# EAGLE board controller-teensy-4 (EAGLE 6.4)
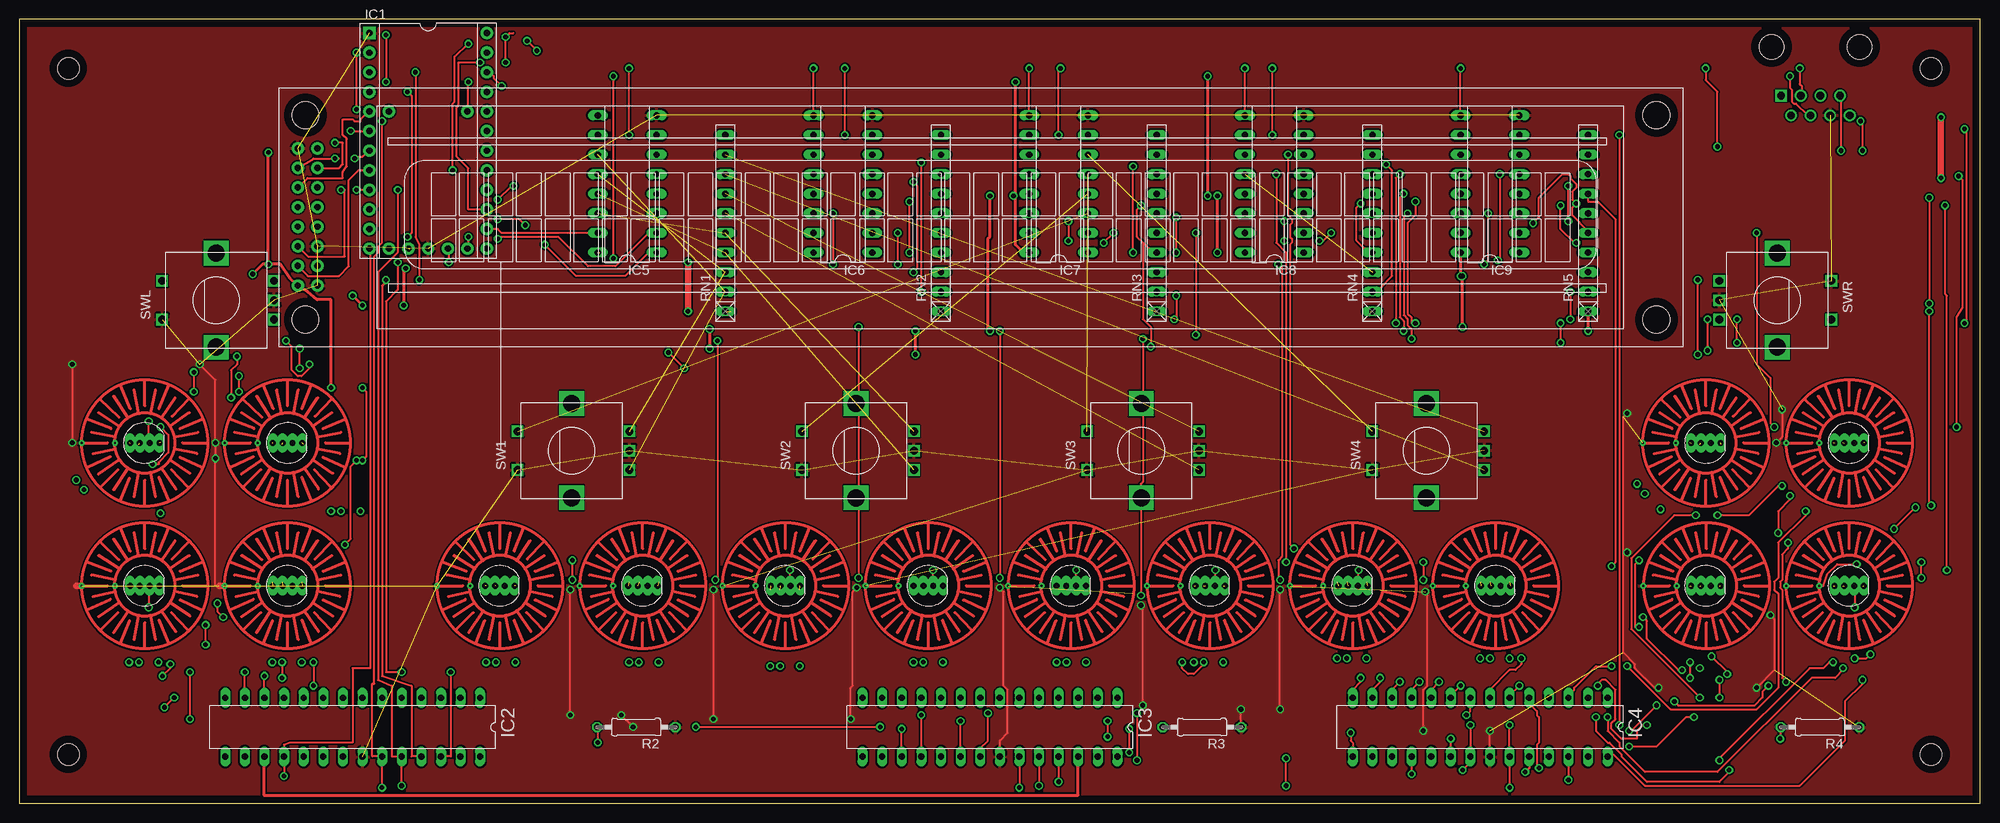
[diagram p1: board, top side]
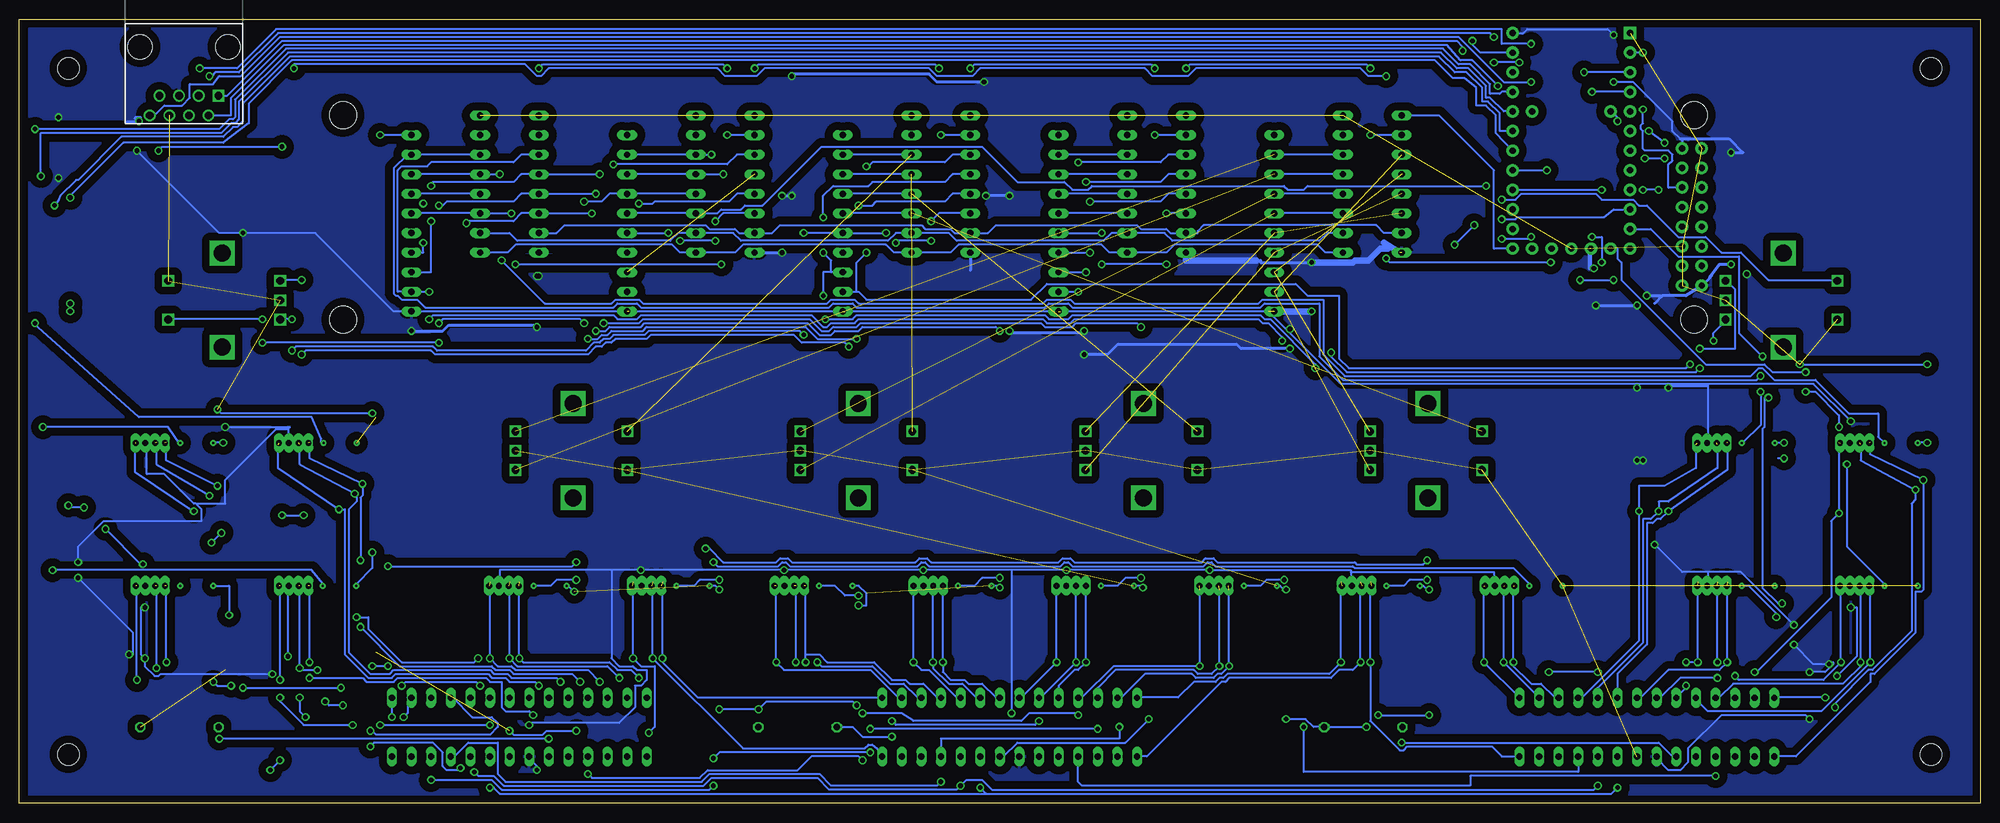
[diagram p2: board, bottom side, seen from below]

Size 254 x 101.6 mm. Coordinates in mm from the lower left corner, seen from the top.
Outline: 0,0 254,0 254,101.6 0,101.6 0,0
Copper layers (1*16): Top 0.035mm / dielectric 1.5mm / Bottom 0.035mm
Design rules "default": minimum track width 10mil, minimum drill 24mil, track to track 8mil, track to pad 8mil, pad to pad 8mil, via to via 8mil, smd to smd 8mil, copper to edge 40mil, drill to drill 8mil, minimum pad ring 10mil, minimum via ring 8mil, stop-mask expansion 4mil, vias tented up to drill 0mil, thermal gap 10mil
Holes 2.8 mm at 6.35,95.25 6.35,6.35 247.65,6.35 247.65,95.25

## Footprints (pad centres in the part's own frame; a part is rotated, then mirrored left to right if it is on the bottom)
LED-RGB-THRU = drill 0.762 pad 0.889 long: 1 1.905,0; 2 0.635,0; 3 -0.635,0 | drill 0.762 pad 0.508 long: 4 -1.905,0
RJ45-8 = drill 1 square: 1 -4.445,6.35 | drill 1: 2 -3.175,8.89; 3 -1.905,6.35; 4 -0.635,8.89; 5 0.635,6.35; 6 1.905,8.89; 7 3.175,6.35; 8 4.445,8.89 | hole 3.2: -5.715,0; 5.715,0
TEENSY = drill 0.813 pad 1.6: 5V2 13.97,-2.54; +5V -13.97,7.62; B0 -11.43,-7.62; B1 -8.89,-7.62; B2 -6.35,-7.62; B3 -3.81,-7.62; B4 8.89,7.62; B5 6.35,7.62; B6 3.81,7.62; B7 -1.27,-7.62; C6 11.43,-7.62; C7 13.97,-7.62; D0 1.27,-7.62; D1 3.81,-7.62; D2 6.35,-7.62; D3 8.89,-7.62; D4 13.97,5.08; D5 13.97,-5.08; D6 13.97,7.62; D7 11.43,7.62; E6 -3.81,-5.08; F0 -11.43,7.62; F1 -8.89,7.62; F4 -6.35,7.62; F5 -3.81,7.62; F6 -1.27,7.62; F7 1.27,7.62; GRND1 13.97,0; REF -3.81,5.08; RST 13.97,2.54 | drill 0.813 pad 1.6 square: GND -13.97,-7.62
DIP28 = drill 0.813 long: 1 -15.24,-3.81; 2 -12.7,-3.81; 3 -10.16,-3.81; 4 -7.62,-3.81; 5 -5.08,-3.81; 6 -2.54,-3.81; 7 0,-3.81; 8 2.54,-3.81; 9 5.08,-3.81; 10 7.62,-3.81; 11 10.16,-3.81; 12 12.7,-3.81; 13 15.24,-3.81; 14 17.78,-3.81; 15 17.78,3.81; 16 15.24,3.81; 17 12.7,3.81; 18 10.16,3.81; 19 7.62,3.81; 20 5.08,3.81; 21 2.54,3.81; 22 0,3.81; 23 -2.54,3.81; 24 -5.08,3.81; 25 -7.62,3.81; 26 -10.16,3.81; 27 -12.7,3.81; 28 -15.24,3.81
DIL16 = drill 0.813 long: 1 -8.89,-3.81; 2 -6.35,-3.81; 3 -3.81,-3.81; 4 -1.27,-3.81; 5 1.27,-3.81; 6 3.81,-3.81; 7 6.35,-3.81; 8 8.89,-3.81; 9 8.89,3.81; 10 6.35,3.81; 11 3.81,3.81; 12 1.27,3.81; 13 -1.27,3.81; 14 -3.81,3.81; 15 -6.35,3.81; 16 -8.89,3.81
0207/10 = drill 0.813 octagon: 1 -5.08,0; 2 5.08,0
RN-10 = drill 0.813 long: 1 -11.43,0; 2 -8.89,0; 3 -6.35,0; 4 -3.81,0; 5 -1.27,0; 6 1.27,0; 7 3.81,0; 8 6.35,0; 9 8.89,0; 10 11.43,0
ALPS_EC12E_SW = drill 1 square: A -2.5,-7.5; B 2.5,-7.5; C 0,-7.5; D -2.5,7; E 2.5,7 | drill 2.2 square: GND1 -6.1,0; GND2 6.1,0
BMP = drill 0.254: P$1 -8.159,0; P$2 -3.858,0
LCD1602 = drill 0.813 pad 1.6: 1 5.04,7.92; 2 2.5,7.92; 3 5.04,10.46; 4 2.5,10.46; 5 5.04,13; 6 2.5,13; 7 5.04,15.54; 8 2.5,15.54; 9 5.04,18.08; 10 2.5,18.08; 11 5.04,20.62; 12 2.5,20.62; 13 5.04,23.16; 14 2.5,23.16; 15 5.04,25.7; 16 2.5,25.7 | hole 3.5: 3.5,3.5; 3.5,30; 178.5,30; 178.5,3.5

## Placement (x,y rotation side)
D1  LED-RGB-CA-THRUDIFFUSE  [LED-RGB-THRU]  62.25,28.2 0 top
D2  LED-RGB-CA-THRUDIFFUSE  [LED-RGB-THRU]  80.75,28.2 0 top
D3  LED-RGB-CA-THRUDIFFUSE  [LED-RGB-THRU]  99.25,28.2 0 top
D4  LED-RGB-CA-THRUDIFFUSE  [LED-RGB-THRU]  117.75,28.2 0 top
D5  LED-RGB-CA-THRUDIFFUSE  [LED-RGB-THRU]  136.25,28.2 0 top
D6  LED-RGB-CA-THRUDIFFUSE  [LED-RGB-THRU]  154.25,28.2 0 top
D7  LED-RGB-CA-THRUDIFFUSE  [LED-RGB-THRU]  172.75,28.2 0 top
D8  LED-RGB-CA-THRUDIFFUSE  [LED-RGB-THRU]  191.25,28.2 0 top
DL1  LED-RGB-CA-THRUDIFFUSE  [LED-RGB-THRU]  16.25,46.7 0 top
DL2  LED-RGB-CA-THRUDIFFUSE  [LED-RGB-THRU]  34.75,46.7 0 top
DL3  LED-RGB-CA-THRUDIFFUSE  [LED-RGB-THRU]  16.25,28.2 0 top
DL4  LED-RGB-CA-THRUDIFFUSE  [LED-RGB-THRU]  34.75,28.2 0 top
DR1  LED-RGB-CA-THRUDIFFUSE  [LED-RGB-THRU]  218.46,46.7 0 top
DR2  LED-RGB-CA-THRUDIFFUSE  [LED-RGB-THRU]  237.04,46.7 0 top
DR3  LED-RGB-CA-THRUDIFFUSE  [LED-RGB-THRU]  218.46,28.2 0 top
DR4  LED-RGB-CA-THRUDIFFUSE  [LED-RGB-THRU]  237.04,28.2 0 top
EXPANSION  RJ45-8PTH  [RJ45-8]  232.66,98.04 180 bottom
IC1  TEENSY  [TEENSY]  52.96,85.85 270 top
IC2  LEDPWM1  [DIP28]  44.45,9.88 180 top
IC3  LEDPWM2  [DIP28]  127,9.88 180 top
IC4  LEDPWM3  [DIP28]  190.5,9.88 180 top
IC5  74HC165-PN  [DIL16]  78.74,80.26 90 top
IC6  74HC165-PN  [DIL16]  106.68,80.26 90 top
IC7  74HC165-PN  [DIL16]  134.62,80.26 90 top
IC8  74HC165-PN  [DIL16]  162.56,80.26 90 top
IC9  74HC165-PN  [DIL16]  190.5,80.26 90 top
R2  2k  [0207/10]  79.91,9.88 180 top
R3  2k  [0207/10]  153.2,9.88 180 top
R4  2k  [0207/10]  233.24,9.88 180 top
RN1  10k  [RN-10]  91.44,75.18 90 top
RN2  10k  [RN-10]  119.38,75.18 90 top
RN3  10k  [RN-10]  147.32,75.18 90 top
RN4  10k  [RN-10]  175.26,75.18 90 top
RN5  10k  [RN-10]  203.2,75.18 90 top
SW1  EC12E_SW  [ALPS_EC12E_SW]  71.53,45.7 90 top
SW2  EC12E_SW  [ALPS_EC12E_SW]  108.39,45.7 90 top
SW3  EC12E_SW  [ALPS_EC12E_SW]  145.32,45.7 90 top
SW4  EC12E_SW  [ALPS_EC12E_SW]  182.25,45.7 90 top
SWCH1  [BMP]  62.25,28.2 0 top
SWCH2  [BMP]  80.75,28.2 0 top
SWCH3  [BMP]  99.25,28.2 0 top
SWCH4  [BMP]  117.75,28.2 0 top
SWCH5  [BMP]  136.25,28.2 0 top
SWCH6  [BMP]  154.25,28.2 0 top
SWCH7  [BMP]  172.75,28.2 0 top
SWCH8  [BMP]  191.25,28.2 0 top
SWL  EC12E_SW  [ALPS_EC12E_SW]  25.5,65.2 90 top
SWL1  [BMP]  16.25,46.7 0 top
SWL2  [BMP]  34.75,46.7 0 top
SWL3  [BMP]  16.25,28.2 0 top
SWL4  [BMP]  34.75,28.2 0 top
SWR  EC12E_SW  [ALPS_EC12E_SW]  227.71,65.2 270 top
SWR1  [BMP]  218.46,46.7 0 top
SWR2  [BMP]  237.04,46.7 0 top
SWR3  [BMP]  218.54,28.2 0 top
SWR4  [BMP]  237.04,28.2 0 top
X1  HD44780LCD-1602  [LCD1602]  33.57,59.18 0 top

## Tracks (layer width: path | path; a pad name or v marks a point on that pad's centre or on a via)
+5V  (via drill 0.6)  (6 unrouted)
  Top 0.254: v47.5,99.57 v47.5,93.47 | v246.38,29.21 v246.38,31.24 | v239.78,19.3 239.27,18.8 v237.74,18.8 | v237.74,25.4 237.74,28.19 DR4.2 | v219.2,19.05 221.23,17.02 v221.23,16.76 | v173.48,30.23 173.48,28.45 D7.2 | v154.94,30.23 154.94,28.45 D6.2 | v186.94,4.32 187.71,5.08 187.71,6.1 187.96,6.35 v187.96,10.16 | v136.91,30.23 136.91,28.45 D5.2 | v118.36,30.23 118.36,28.45 D4.2 | v99.82,30.23 99.82,28.45 D3.2 | v125.48,11.68 125.48,8.13 124.46,7.11 IC3.21 | v24.13,20.57 v24.13,23.11 | v19.56,18.03 19.56,17.53 v18.54,16.51 | v16.76,25.4 16.76,28.19 DL3.2 | v238.51,88.39 238.76,88.14 v238.76,84.58 | v16.76,49.53 16.76,46.74 DL1.2 | v22.1,17.02 v22.1,10.92 | v227.33,48.77 226.82,49.28 226.82,55.12 225.04,56.9 v225.04,73.91 | v44.45,44.45 44.96,44.96 44.96,53.34 v44.45,53.85 | v43.69,44.45 42.93,43.69 42.93,34.29 v42.16,33.53
  Top 0.406: IC7.16 130.81,70.87 130.56,70.87 129.03,72.39 129.03,78.49 v128.78,78.74 129.03,78.74 v129.03,93.47 | v125.73,78.74 125.73,73.41 125.48,73.15 125.48,61.47 v125.73,61.21 | v116.08,58.17 v116.08,61.21 | v89.41,61.47 v89.41,58.93 | v155.19,71.37 v155.19,78.74 | v153.92,94.23 v153.92,78.74 | IC9.16 v186.69,68.33 | v186.94,61.72 v186.94,68.33 | RN5.1 v203.2,61.21 | v32.26,69.85 v32.26,84.33 | v44.45,64.52 v43.18,65.79 | v49.78,64.52 49.78,69.09 v50.04,69.34 | v30.23,68.58 31.5,69.85 v32.26,69.85 | v32.26,69.85 33.78,69.85 35.05,68.07 36.07,67.06 37.34,66.29 38.61,65.28 40.39,65.28 v40.39,53.85
  Top 0.813: v248.92,88.9 v248.92,81.03 | v86.61,63.75 v86.61,70.1
  Bottom 0.254: v47.5,99.57 48.26,100.33 58.67,100.33 59.18,99.82 IC1.+5V | v47.5,93.47 44.96,93.47 39.88,88.39 39.88,87.12 38.86,86.11 38.61,85.85 X1.15 | 231.14,38.86 231.39,38.86 235.2,42.67 237.49,42.67 237.49,46.48 DR2.2 | 231.14,38.86 230.38,38.1 230.38,36.58 243.08,36.58 246.38,33.27 v246.38,31.24 | v246.38,29.21 239.27,22.1 239.27,19.3 v239.78,19.3 | v237.74,25.4 238.25,25.4 238.25,19.3 v237.74,18.8 237.74,17.78 236.47,16.51 235.97,16.51 235.71,16.76 v221.23,16.76 | 219.2,48.51 219.2,46.74 DR1.2 | 219.2,48.51 220.73,48.51 227.33,41.91 227.33,38.86 231.14,38.86 | v219.2,19.05 219.2,28.19 DR3.2 | 177.29,30.23 v173.48,30.23 v154.94,30.23 v136.91,30.23 125.48,30.23 | 177.29,30.23 191.77,30.23 191.77,28.45 D8.2 | v186.94,4.32 186.94,4.83 187.96,5.84 IC4.21 | v187.96,10.16 187.71,10.41 176.28,10.41 174.24,12.45 174.24,15.24 173.48,15.24 172.72,16 172.72,17.27 173.99,17.27 174.5,17.78 176.28,17.78 177.29,18.8 177.29,30.23 | 125.48,30.23 v118.36,30.23 v99.82,30.23 81.53,30.23 81.53,29.97 | 125.48,30.23 v125.48,11.68 | 81.53,29.97 81.53,28.45 D2.2 | 81.53,29.97 62.99,29.97 62.99,28.45 D1.2 | 35.31,29.97 35.31,28.45 DL4.2 | 35.31,29.97 30.99,29.97 v24.13,23.11 | v24.13,20.57 21.59,18.03 v19.56,18.03 19.81,18.29 19.05,18.29 19.05,18.03 20.07,17.02 v22.1,17.02 | v18.54,16.51 16,19.05 16,25.4 v16.76,25.4 | v238.51,88.39 238.76,88.39 239.01,88.14 240.03,88.14 240.03,88.39 239.01,88.39 238.76,88.65 238.25,88.65 238.25,88.9 239.01,88.9 239.07,88.72 | v238.76,84.58 228.09,73.91 v225.04,73.91 215.65,73.91 205.49,63.75 203.45,63.75 203.2,64.01 202.95,63.75 175.51,63.75 175.26,64.01 175.01,63.75 147.57,63.75 147.32,64.01 147.07,63.75 119.63,63.75 119.38,64.01 119.13,63.75 92.2,63.75 89.92,61.47 82.8,54.36 44.45,54.36
  Bottom 0.254: 35.31,54.36 21.59,54.36 v16.76,49.53 | 35.31,54.36 44.45,54.36 | 35.31,54.36 35.31,54.1 35.31,46.74 DL2.2 | v22.1,10.92 22.61,11.43 33.53,11.43 37.85,7.11 37.85,5.33 38.86,4.32 40.39,4.32 41.91,5.84 IC2.21 | 219.2,48.51 218.95,48.77 v227.33,48.77 | v44.45,44.45 v43.69,44.45 43.43,44.45 | 44.45,54.36 v44.45,53.85 | v42.16,33.53 38.61,29.97 35.31,29.97
  Bottom 0.406: 36.07,67.06 35.05,68.07 | 35.05,68.07 34.87,68.37 | 34.87,68.37 33.78,69.85 v32.26,69.85 | 36.07,67.06 38.1,65.79 | 35.05,68.07 34.8,68.33 34.87,68.37 | 41.27,65.66 41.15,65.79 38.1,65.79 | 41.27,65.66 42.16,64.77 | 38.1,65.79 37.34,66.29 36.07,67.06 | 36.07,67.06 X1.2 | 93.73,70.36 93.22,70.36 93.22,70.1 v86.61,70.1 | IC7.16 130.81,69.09 | v125.73,78.74 v128.78,78.74 | v125.73,61.21 125.48,60.96 116.33,60.96 v116.08,61.21 | v116.08,58.17 113.03,58.17 111.76,59.44 96.27,59.44 95.76,58.93 v89.41,58.93 | 89.92,61.47 v89.41,61.47 | v155.19,78.74 v153.92,78.74 | IC8.16 v155.19,71.37 | v153.92,94.23 153.67,94.49 136.14,94.49 135.13,93.47 v129.03,93.47 | v186.94,68.33 v186.69,68.33 | v186.94,61.72 187.2,61.98 198.37,61.98 199.14,61.21 v203.2,61.21 | 38.86,86.11 32.51,86.11 30.73,84.33 v32.26,84.33 | v43.18,65.79 41.4,65.79 41.27,65.66 | v49.78,64.52 v44.45,64.52 | v50.04,69.34 50.55,69.34 | v30.23,68.58 29.97,68.58 | v40.39,53.85 40.13,54.1 35.31,54.1
  Bottom 0.61: 50.55,71.88 50.55,69.34
  Bottom 0.813: 75.18,71.37 76.51,72.2 | 76.51,72.2 77.22,72.64 | v86.61,70.1 81.28,70.1 81.03,70.36 79.25,70.36 77.72,71.88 76.71,71.88 76.51,72.2 | RN1.1 v86.61,63.75 | IC6.16 102.87,70.36 93.73,70.36
  pour Bottom (isolate 1.016): 1,100.4 252.7,100.4 252.7,1 1,1
AREF  (via drill 0.6)
  Top 0.254: v58.17,93.47 58.17,89.66 IC1.REF
  Bottom 0.254: v58.17,93.47 61.72,93.47 67.56,99.31 220.22,99.31 225.3,94.23 228.09,94.23 228.85,93.22 231.9,93.22 231.9,91.44 232.92,90.42 235.2,90.42 236.47,89.15 EXPANSION.8
BLANK  (via drill 0.6)
  Top 0.254: v193.04,2.03 IC4.23 v193.04,10.16 | v207.26,86.61 v207.26,10.16 | v46.99,88.39 46.99,72.64 46.48,72.14 46.48,71.37 45.97,70.87 45.97,15.49 45.72,15.49 45.72,6.1 46.99,6.1 IC2.23 v46.99,2.03 | IC3.23 v129.54,2.03
  Bottom 0.254: v207.26,10.16 v193.04,10.16 | RN5.10 v207.26,86.61 | v46.99,88.39 46.99,88.9 47.75,89.66 IC1.E6 | v46.99,2.03 47.75,1.27 128.78,1.27 | v129.54,2.03 128.78,1.27 | 128.78,1.27 191.77,1.27 192.53,2.03 v193.04,2.03
CLKENABLE
  Top 0.254: IC1.D7 61.98,74.42 62.48,73.91 IC5.15
  Bottom 0.254: IC5.15 77.22,73.91 78.23,74.93 100.58,74.93 101.35,74.17 101.35,73.91 IC6.15 104.9,73.91 105.41,74.42 108.71,74.42 109.22,74.93 127.51,74.93 128.52,73.91 IC7.15 132.84,73.91 133.35,74.42 136.65,74.42 137.16,74.93 155.45,74.93 156.46,73.91 IC8.15 160.78,73.91 161.29,74.42 164.59,74.42 165.1,74.93 183.39,74.93 184.4,73.91 IC9.15
ENC1A  (2 unrouted)
ENC1B  (2 unrouted)
ENC1SW  (1 unrouted)
  Bottom 0.254: IC7.3 RN3.6
ENC2A  (2 unrouted)
ENC2B  (2 unrouted)
ENC2SW  (1 unrouted)
  Bottom 0.254: IC7.4 RN3.7
ENC3A  (1 unrouted)
  Bottom 0.254: IC5.3 RN1.6
ENC3B  (1 unrouted)
  Bottom 0.254: IC5.4 RN1.7
ENC3SW  (1 unrouted)
  Bottom 0.254: IC7.5 RN3.8
ENC4A  (1 unrouted)
  Bottom 0.254: IC5.5 RN1.8
ENC4B  (1 unrouted)
  Bottom 0.254: IC5.6 RN1.9
ENC4SW  (1 unrouted)
  Bottom 0.254: IC7.6 RN3.9
ENC5A  (via drill 0.6)
  Top 0.254: v116.84,66.29 v116.84,83.06
  Bottom 0.254: v116.84,83.06 106.17,83.06 105.16,84.07 IC6.11 | RN2.2 v116.84,66.29
ENC5B  (via drill 0.6)
  Top 0.254: v115.82,80.52 116.33,80.01 116.33,69.34 v115.82,68.83
  Bottom 0.254: IC6.12 105.16,81.53 106.17,80.52 v115.82,80.52 116.08,80.52 | RN2.3 v115.82,68.83
ENC5SW  (via drill 0.6)
  Top 0.254: v177.04,82.8 177.8,82.04 177.8,68.33 176.28,66.8 175.26,66.8 RN4.2
  Bottom 0.254: IC8.11 161.04,84.07 162.31,82.8 v177.04,82.8 177.29,82.8
ENC6A  (via drill 0.6)
  Top 0.254: v115.32,71.37 v115.32,77.98
  Bottom 0.254: v115.32,77.98 106.17,77.98 105.16,78.99 IC6.13 | RN2.4 v115.32,71.37
ENC6B  (via drill 0.6)
  Top 0.254: v113.79,69.85 v113.79,73.91 | v105.41,76.45 v105.41,69.85
  Bottom 0.254: v105.41,69.85 v113.79,69.85 | IC6.14 v105.41,76.45 | RN2.5 v113.79,73.91
ENC6SW  (1 unrouted)
ENC7A
  Bottom 0.254: IC6.3 RN2.6
ENC7B
  Bottom 0.254: IC6.4 RN2.7
ENC7SW  (via drill 0.6)
  Top 0.254: v173.74,77.72 173.23,77.22 173.23,72.9 174.24,71.88 175.26,71.88 RN4.4
  Bottom 0.254: IC8.13 161.04,78.99 162.05,77.98 171.7,77.98 171.96,77.72 v173.74,77.72
ENC8A
  Bottom 0.254: IC6.5 RN2.8
ENC8B
  Bottom 0.254: IC6.6 RN2.9
ENC8SW  (via drill 0.6)
  Top 0.254: v169.93,73.91 168.91,72.9 v168.4,72.9 | v163.83,75.44 v163.83,72.9
  Bottom 0.254: v163.83,72.9 v168.4,72.9 | v163.83,75.44 162.81,76.45 IC8.14 | RN4.5 v169.93,73.91
ENCLA  (via drill 0.6)
  Top 0.254: v144.27,71.37 v144.27,82.55 | v34.54,59.94 35.31,59.18 35.31,56.13 36.07,55.37 36.58,55.37 37.59,56.39 v37.59,56.9
  Bottom 0.254: IC7.11 133.1,84.07 134.11,83.06 143.51,83.06 144.02,82.55 v144.27,82.55 | v144.27,71.37 145.54,70.1 145.54,66.29 | RN3.2 145.54,66.29 | v34.54,59.94 34.54,60.96 33.02,62.48 SWL.A | v37.59,56.9 38.1,56.39 81.79,56.39 83.06,57.66 83.06,65.79 87.12,65.79 88.65,67.31 120.9,67.31 122.94,65.28 144.27,65.28 145.29,66.29 145.54,66.29
ENCLB  (via drill 0.6)
  Top 0.254: v149.86,71.37 v149.86,75.95 | v36.32,56.39 v36.32,58.93 | v86.11,56.39 v84.07,58.42 | v149.61,62.74 149.86,62.99 v149.86,65.79
  Bottom 0.254: IC7.12 133.1,81.53 134.11,80.52 143.51,80.52 144.02,80.01 148.59,80.01 149.86,78.74 v149.86,75.95 | v149.86,71.37 148.84,70.36 148.84,68.83 | RN3.3 148.84,68.83 | v36.32,58.93 31.75,58.93 31.75,66.55 32.77,67.56 SWL.B | v36.32,56.39 36.83,55.88 82.04,55.88 84.07,57.91 v84.07,58.42 | v86.11,56.39 86.11,56.9 91.95,62.74 92.71,62.74 93.22,63.25 117.6,63.25 118.11,62.74 120.65,62.74 121.16,63.25 145.54,63.25 146.05,62.74 v149.61,62.74 | v149.86,65.79 149.86,68.83 148.84,68.83
ENCLSW  (via drill 0.6)
  Top 0.254: v61.98,78.23 63.75,80.01 v64.01,80.01
  Bottom 0.254: RN4.6 IC8.3 163.58,76.45 163.07,76.96 160.53,76.96 160.02,77.47 157.73,77.47 150.11,85.09 129.29,85.09 124.71,80.52 118.62,80.52 117.6,79.5 115.57,79.5 115.06,80.01 90.17,80.01 89.66,79.5 87.63,79.5 87.12,80.01 v64.01,80.01 | v61.98,78.23 60.2,78.23 59.44,78.99 49.78,78.99 49.02,78.23 44.96,78.23 44.2,77.47 43.18,77.47 39.12,73.41 35.56,73.41 33.53,71.37 30.99,71.37 27.43,67.82 18.54,67.82 SWL.E
ENCRA  (via drill 0.6)
  Top 0.254: v145.29,77.47 144.78,76.96 144.78,73.41 145.54,72.64 | 145.54,72.64 146.3,71.88 147.32,71.88 RN3.4 | v217.42,58.17 v217.42,67.82 | v146.56,59.18 146.56,61.72 145.54,62.74 145.54,72.64
  Bottom 0.254: IC7.13 133.1,78.99 134.11,77.98 143,77.98 143.51,77.47 v145.29,77.47 | v217.42,67.82 219.96,67.82 SWR.A | v217.42,58.17 216.92,58.67 200.66,58.67 200.15,58.17 180.34,58.17 179.32,59.18 178.56,59.18 178.05,59.69 177.29,59.69 176.78,60.2 172.72,60.2 172.21,60.71 153.67,60.71 152.65,59.69 147.07,59.69 v146.56,59.18
ENCRB  (via drill 0.6)
  Top 0.254: v140.46,72.64 v141.73,73.91 | v135.89,75.44 v135.89,72.9 | v218.69,58.67 v218.69,62.74 | v152.4,73.91 v152.4,60.71
  Bottom 0.254: v140.46,72.64 140.21,72.9 v135.89,72.9 | v135.89,75.44 134.87,76.45 IC7.14 | v141.73,73.91 RN3.5 v152.4,73.91 | v218.69,62.74 219.96,62.74 SWR.B | v218.69,58.67 218.19,59.18 200.41,59.18 199.9,58.67 180.59,58.67 179.58,59.69 178.82,59.69 178.31,60.2 177.55,60.2 177.04,60.71 172.97,60.71 172.47,61.21 152.91,61.21 v152.4,60.71
ENCRSW  (via drill 0.6)
  Top 0.254: v222.5,59.69 v222.5,62.74 | v199.64,62.23 v199.64,59.69 | v180.85,62.23 180.34,62.23 180.34,62.99 179.83,63.5 179.83,75.18 180.85,76.2 v180.85,77.98
  Bottom 0.254: IC8.4 RN4.7 177.55,78.99 178.56,77.98 v180.85,77.98 | v222.5,62.74 234.7,62.74 SWR.E | v199.64,59.69 v222.5,59.69 | v199.64,62.23 199.14,62.74 181.36,62.74 v180.85,62.23
EXPIO-1  (via drill 0.6)
  Top 0.254: v67.06,97.54 v65.79,98.81
  Bottom 0.254: IC1.F0 64.77,97.28 66.04,98.55 v65.79,98.81 | v67.06,97.54 67.06,98.04 67.82,98.81 219.96,98.81 227.08,91.69 EXPANSION.1
EXPIO-2  (via drill 0.6)
  Top 0.254: v62.48,92.96 61.47,93.98 61.47,94.23 61.21,94.49 60.71,94.49 60.71,94.74 IC1.F1
  Bottom 0.254: v62.48,92.96 65.79,96.27 67.31,96.27 69.09,98.3 219.71,98.3 226.57,91.44 226.57,89.15 EXPANSION.2
EXPIO-3  (via drill 0.6)
  Top 0.254: v56.13,82.04 56.13,90.68 56.39,90.93 56.39,96.77 v58.17,98.42 | v230.63,95.25 230.63,93.22 230.89,92.96 230.89,91.69 EXPANSION.3
  Bottom 0.254: IC1.B6 v56.13,82.04 | v230.63,95.25 225.81,95.25 220.73,100.33 61.98,100.33 61.98,98.42 v58.17,98.42
EXPIO-4  (via drill 0.6)
  Top 0.254: IC1.B4 58.17,76.96 58.17,82.3 56.64,83.82 56.64,90.17 56.9,90.42 56.9,96.01 59.18,96.01 59.44,96.27 v59.69,96.01 | v62.99,96.01 v62.99,99.31 63.5,99.82 64.01,99.82 | v229.36,94.23 229.36,92.71 229.62,92.46 229.62,90.93 229.87,90.68 230.12,90.68 231.65,89.15 EXPANSION.4
  Bottom 0.254: v59.69,96.01 v62.99,96.01 | v229.36,94.23 229.11,94.23 228.6,94.74 225.55,94.74 220.47,99.82 63.5,99.82 v62.99,99.31
GND  (via drill 0.6)  (36 unrouted)
  Top 0.254: v227.58,46.74 228.35,47.5 v228.35,51.05 | v208.28,50.55 207.77,50.04 207.77,32.51 | 207.77,32.51 207.77,19.56 209.3,18.03 209.3,17.53 211.84,14.99 v212.34,14.99 | v225.04,14.99 227.33,17.27 227.33,23.88 v226.82,24.38 | 207.77,32.51 v208.28,32.51 | v182.12,27.43 182.37,27.18 182.37,15.24 181.86,14.73 v181.86,9.4 | IC4.22 v190.5,9.4 | v163.32,12.19 v163.32,27.69 | v158.24,12.19 158.24,9.91 R3.1 | v145.29,25.65 145.54,25.4 v145.54,12.7 | v127,27.94 127.51,27.43 127.51,15.24 128.02,14.73 128.02,9.14 127,8.13 IC3.22 | v108.46,27.94 107.95,27.43 107.95,15.24 107.7,14.99 v107.7,10.92 | v89.92,10.92 v89.92,27.69 | v71.37,11.43 v71.37,27.69 | v79.5,9.91 v77.98,11.43 | v6.86,56.9 v6.86,46.74 | v23.37,56.9 25.4,54.86 v25.4,46.74 v25.4,44.7 25.4,28.19
  Top 0.813: 8.13,28.19 7.37,28.19 | 26.42,28.19 25.91,28.19
  Bottom 0.254: v227.58,46.74 228.85,46.74 SWR2.P$1 | v228.35,51.05 227.84,50.55 v208.28,50.55 | v225.04,14.99 v212.34,14.99 | v226.82,24.38 226.82,28.19 228.85,28.19 SWR4.P$1 | v208.28,32.51 208.28,30.48 210.31,28.45 SWR3.P$1 | v182.12,27.43 182.88,28.19 SWCH8.P$1 | v181.86,9.4 185.67,9.4 186.18,8.89 189.99,8.89 v190.5,9.4 | v163.32,27.69 163.83,28.19 164.34,28.19 SWCH7.P$1 | v163.32,12.19 v158.24,12.19 157.23,13.21 146.05,13.21 v145.54,12.7 | v145.29,25.65 144.27,25.65 144.27,27.18 145.29,28.19 146.05,28.19 SWCH6.P$1 | v127,27.94 127.25,28.19 128.02,28.19 SWCH5.P$1 | v108.46,27.94 108.71,28.19 109.47,28.19 SWCH4.P$1 | v107.7,10.92 110.74,7.87 124.71,7.87 126.49,6.1 127,6.1 IC3.22 | v89.92,27.69 90.17,27.69 90.68,28.19 90.93,28.19 SWCH3.P$1 | v89.92,10.92 87.38,10.92 86.36,9.91 85.09,9.91 R2.1 84.84,9.91 v79.5,9.91 | v71.37,27.69 71.63,27.69 72.14,28.19 72.39,28.19 SWCH2.P$1 | v77.98,11.43 v71.37,11.43 | v6.86,46.74 7.87,46.74 SWL1.P$1 | v23.37,56.9 v6.86,56.9 | v25.4,46.74 26.42,46.74 SWL2.P$1 | v25.4,44.7 26.16,44.7
  pour Top: 0,101.4 253.7,101.4 253.7,1 0,1
GSCLK  (via drill 0.6)
  Top 0.254: v34.29,3.56 IC2.18 34.29,7.62 35.05,7.87 43.18,7.87 43.18,17.53 45.47,17.53 45.47,71.88 IC1.C7 | IC4.18 v180.34,3.81 | v144.78,11.68 v144.78,5.59 | IC3.18 v116.84,11.43
  Bottom 0.254: v34.29,3.56 66.04,3.56 66.04,2.29 116.33,2.29 116.84,2.79 IC3.18 | v180.34,3.81 179.83,3.3 165.86,3.3 164.85,4.32 153.16,4.32 151.38,6.1 145.29,6.1 v144.78,5.59 | v144.78,11.68 139.7,11.68 138.18,10.67 124.21,10.67 123.19,11.68 117.09,11.68 v116.84,11.43
IC6-IC5  (via drill 0.6)
  Top 0.254: v78.99,86.61 v78.99,95.25 | IC6.9 v102.87,95.25
  Bottom 0.254: IC5.10 v78.99,86.61 | v78.99,95.25 79.5,95.76 102.36,95.76 v102.87,95.25
IC7-IC6  (via drill 0.6)
  Top 0.254: v106.93,86.61 v106.93,95.25 | IC7.9 v130.81,95.25
  Bottom 0.254: IC6.10 v106.93,86.61 | v106.93,95.25 107.44,95.76 130.3,95.76 v130.81,95.25
IC8-IC7  (via drill 0.6)
  Top 0.254: v134.62,86.61 134.62,95.25 v134.87,95.25 | IC8.9 v158.75,95.25
  Bottom 0.254: IC7.10 v134.62,86.61 | v134.87,95.25 135.38,95.76 158.24,95.76 v158.75,95.25
IC9-IC8  (via drill 0.6)
  Top 0.254: v162.31,86.61 v162.31,95.25 | IC9.9 v186.69,95.25
  Bottom 0.254: IC8.10 v162.31,86.61 | v162.31,95.25 162.81,95.76 186.18,95.76 v186.69,95.25
L1B  (via drill 0.6)  (1 unrouted)
  Bottom 0.254: 60.45,28.19 v60.45,18.29 60.71,18.03 58.17,15.49 56.9,15.49 55.12,13.72 54.61,13.72 IC2.3
L1G  (via drill 0.6)  (1 unrouted)
  Bottom 0.254: 61.72,28.19 v61.72,18.29 57.15,13.72 IC2.2
L1R  (via drill 0.6)  (1 unrouted)
  Bottom 0.254: 64.26,28.19 v64.26,18.29 59.69,13.72 IC2.1
L2B  (via drill 0.6)  (1 unrouted)
  Bottom 0.254: 78.99,28.7 v78.99,18.29 78.99,10.67 75.18,6.86 74.68,6.86 74.17,7.37 63.25,7.37 61.98,6.1 59.69,6.1 IC2.28
L2G  (via drill 0.6)  (1 unrouted)
  Bottom 0.254: 80.26,28.7 v80.26,18.29 81.28,17.27 83.06,17.27 84.07,16.26 97.28,16.26 97.79,15.75 98.3,15.75 107.95,6.1 109.22,6.1 IC3.15
L2R  (via drill 0.6)  (1 unrouted)
  Bottom 0.254: 82.8,28.7 v82.8,18.29 84.33,16.76 97.54,16.76 98.04,16.26 98.55,16.26 99.06,15.75 101.85,15.75 103.89,13.72 109.22,13.72 IC3.14
L3B  (via drill 0.6)  (1 unrouted)
  Bottom 0.254: 97.28,27.69 v97.28,17.78 98.3,16.76 98.81,16.76 99.31,16.26 101.6,16.26 102.11,16.76 108.2,16.76 111.25,13.72 111.76,13.72 IC3.13
L3G  (via drill 0.6)  (1 unrouted)
  Bottom 0.254: 98.55,27.69 v98.55,17.78 99.57,16.76 101.35,16.76 101.85,17.27 112.01,17.27 114.3,14.99 IC3.12
L3R  (via drill 0.6)  (1 unrouted)
  Bottom 0.254: 101.09,27.69 v101.09,17.78 112.27,17.78 116.33,13.72 116.84,13.72 IC3.11
L4B  (via drill 0.6)  (1 unrouted)
  Bottom 0.254: 115.82,28.19 v115.82,18.29 116.84,17.27 117.35,17.27 119.38,15.24 IC3.10
L4G  (via drill 0.6)  (1 unrouted)
  Bottom 0.254: 117.09,28.19 v117.09,18.29 121.67,13.72 121.92,13.72 IC3.9
L4R  (via drill 0.6)  (1 unrouted)
  Bottom 0.254: 119.63,28.19 v119.63,18.29 124.21,13.72 124.46,13.72 IC3.8
L5B  (via drill 0.6)  (1 unrouted)
  Bottom 0.254: 134.37,28.19 v134.37,18.29 134.37,17.02 133.35,16 131.57,16 131.06,15.49 129.29,15.49 127.51,13.72 127,13.72 IC3.7
L5G  (via drill 0.6)  (1 unrouted)
  Bottom 0.254: 135.64,28.19 v135.64,18.29 135.64,17.53 133.6,15.49 131.83,15.49 130.05,13.72 129.54,13.72 IC3.6
L5R  (via drill 0.6)  (1 unrouted)
  Bottom 0.254: 138.18,28.19 v138.18,18.29 137.16,17.27 136.14,17.27 132.59,13.72 132.08,13.72 IC3.5
L6B  (via drill 0.6)  (1 unrouted)
  Bottom 0.254: v152.15,18.29 152.15,19.3 | 152.15,19.3 152.15,28.19 | 152.15,19.3 150.37,19.3 149.35,18.29 143.26,18.29 140.97,16 139.19,16 138.68,15.49 136.91,15.49 135.13,13.72 134.62,13.72 IC3.4
L6G  (via drill 0.6)  (1 unrouted)
  Top 0.254: v150.62,18.29 150.62,17.53 151.38,16.76 152.15,16.76 153.42,18.03 v153.42,18.29
  Bottom 0.254: v153.42,18.29 153.42,28.19 | v150.62,18.29 150.11,17.78 143.51,17.78 141.22,15.49 139.45,15.49 137.67,13.72 137.16,13.72 IC3.3
L6R  (via drill 0.6)  (1 unrouted)
  Bottom 0.254: 155.96,28.19 v155.96,18.29 154.94,17.27 143.76,17.27 140.21,13.72 139.7,13.72 IC3.2
L7B  (via drill 0.6)  (1 unrouted)
  Bottom 0.254: 170.69,28.7 v170.69,18.8 170.94,18.54 166.12,13.72 142.24,13.72 IC3.1
L7G  (via drill 0.6)  (1 unrouted)
  Bottom 0.254: 171.96,28.7 v171.96,18.8 160.27,7.11 144.53,7.11 144.02,7.62 143.51,7.62 142.24,6.6 IC3.28
L7R  (via drill 0.6)  (1 unrouted)
  Top 0.254: IC4.15 172.72,7.87 172.47,8.13 v172.47,9.14
  Bottom 0.254: 174.5,28.7 v174.5,18.8 173.48,17.78 171.7,17.78 171.7,9.91 v172.47,9.14
L8B  (via drill 0.6)  (1 unrouted)
  Top 0.254: IC4.14 172.72,14.73 173.74,15.75 v173.74,16.26
  Bottom 0.254: 189.23,28.7 v189.23,18.8 188.72,18.29 177.55,18.29 176.53,17.27 174.75,17.27 v173.74,16.26
L8G  (via drill 0.6)  (1 unrouted)
  Top 0.254: IC4.13 175.26,14.73 176.28,15.75 v176.28,16.26
  Bottom 0.254: 190.5,28.7 v190.5,18.8 189.48,17.78 177.8,17.78 v176.28,16.26
L8R  (via drill 0.6)  (1 unrouted)
  Top 0.254: IC4.12 177.8,14.73 v178.82,15.75
  Bottom 0.254: 193.04,28.7 v193.04,18.8 192.02,17.78 190.25,17.78 189.74,17.27 180.34,17.27 v178.82,15.75
LCD-DB4  (via drill 0.6)
  Top 0.254: v43.69,89.92 v43.69,97.28
  Bottom 0.254: X1.11 38.86,79.76 40.39,79.76 40.39,82.8 39.88,83.31 39.88,84.07 40.39,84.58 43.43,84.58 43.69,84.84 43.69,87.12 43.94,87.38 43.94,87.88 43.69,88.14 v43.69,89.92 | v43.69,97.28 IC1.B0
LCD-DB5
  Top 0.254: X1.12 36.32,80.01 37.34,81.03 41.91,81.03 41.91,81.79 42.42,82.55 42.42,86.11 41.91,86.61 41.91,88.65 43.18,88.65 43.43,88.39 44.2,88.39 44.2,88.65 45.21,89.66 IC1.B3
LCD-DB6  (via drill 0.6)
  Top 0.254: X1.13 39.12,82.3 41.4,82.3 41.91,82.8 41.91,85.6 v40.89,85.6 | v42.93,87.12 IC1.B7
  Bottom 0.254: v40.89,85.6 v42.93,87.12
LCD-DB7  (via drill 0.6)
  Top 0.254: X1.14 38.1,83.57 v40.89,83.57 41.4,83.57 | IC1.D0 45.21,84.58 44.45,83.82 43.43,83.82 v43.43,83.57
  Bottom 0.254: v40.89,83.57 v43.43,83.57
LCD-E  (via drill 0.6)
  Top 0.254: X1.6 37.39,70.87 42.16,70.87 42.16,79.5 v41.66,79.5 | v43.69,79.5 IC1.D2
  Bottom 0.254: v41.66,79.5 v43.69,79.5
LCD-RS
  Top 0.254: X1.4 37.34,68.37 37.34,68.33 41.4,68.33 42.67,69.6 42.67,80.77 43.94,82.04 IC1.D1
LL1B  (via drill 0.6)  (1 unrouted)
  Bottom 0.254: 14.22,46.74 14.22,45.21 v7.37,41.91 7.37,27.69 7.62,27.43 8.38,27.43 8.38,22.1 13.72,16.76 14.22,16.76 14.22,15.75 23.88,6.1 26.67,6.1 IC2.15
LL1G  (via drill 0.6)  (1 unrouted)
  Top 0.254: v18.8,12.45 v20.07,13.72
  Bottom 0.254: 15.49,46.48 15.49,44.45 v8.38,40.64 8.38,39.37 8.89,38.86 8.89,22.35 13.97,17.27 14.48,17.27 18.8,12.95 v18.8,12.45 | v20.07,13.72 26.67,13.72 IC2.14
LL1R  (via drill 0.6)  (1 unrouted)
  Top 0.254: IC2.13 v29.21,17.02
  Bottom 0.254: 18.29,46.74 v18.29,37.59 19.3,36.58 19.3,26.67 28.96,17.02 v29.21,17.02
LL2B  (via drill 0.6)  (1 unrouted)
  Bottom 0.254: 32.77,46.74 32.77,43.18 v40.39,37.85 41.4,36.83 41.91,36.83 42.42,36.32 43.18,36.32 43.18,20.57 46.99,16.76 IC2.6
LL2G  (via drill 0.6)  (1 unrouted)
  Bottom 0.254: 34.04,46.48 34.04,43.43 40.39,39.12 41.66,39.12 v41.66,37.85 42.67,36.83 43.69,36.83 43.69,20.83 49.53,14.99 IC2.5
LL2R  (via drill 0.6)  (1 unrouted)
  Bottom 0.254: 36.83,46.48 36.83,43.43 40.89,41.15 44.2,41.15 v44.2,37.85 44.2,21.08 51.56,13.72 52.07,13.72 IC2.4
LL3B  (via drill 0.6)  (1 unrouted)
  Bottom 0.254: 14.22,28.19 v14.22,18.29 20.57,11.94 35.31,11.94 36.83,13.46 IC2.10
LL3G  (via drill 0.6)  (1 unrouted)
  Bottom 0.254: 15.49,28.19 v15.49,18.29 15.24,18.03 17.78,15.49 32,15.49 33.78,13.72 34.29,13.72 IC2.11
LL3R  (via drill 0.6)  (1 unrouted)
  Top 0.254: IC2.12 v31.75,16.51
  Bottom 0.254: 18.03,28.19 v18.03,18.29 20.32,16 31.24,16 v31.75,16.51
LL4B  (via drill 0.6)  (1 unrouted)
  Bottom 0.254: 32.77,28.7 v32.77,18.29 33.78,17.27 40.39,17.27 43.94,13.72 44.45,13.72 IC2.7
LL4G  (via drill 0.6)  (1 unrouted)
  Top 0.254: v34.04,18.29 v34.04,16.26
  Bottom 0.254: v34.04,18.29 34.04,28.7 | v34.04,16.26 38.86,16.26 41.4,13.72 41.91,13.72 IC2.8
LL4R  (via drill 0.6)  (1 unrouted)
  Top 0.254: v38.1,18.29 v38.1,15.24
  Bottom 0.254: 36.58,28.7 v36.58,18.29 v38.1,18.29 | v38.1,15.24 38.1,14.99 39.37,13.72 IC2.9
LR1B  (via drill 0.6)  (1 unrouted)
  Top 0.254: IC4.11 180.34,14.73 v181.36,15.75 | v209.8,22.86 209.3,22.86 209.3,30.99 v209.8,31.5
  Bottom 0.254: 216.41,46.74 216.41,44.7 v209.55,41.4 209.55,39.88 209.8,39.62 v209.8,31.5 | v181.36,15.75 182.37,16.76 189.99,16.76 190.5,17.27 192.28,17.27 192.79,17.78 204.72,17.78 v209.8,22.86
LR1G  (via drill 0.6)  (1 unrouted)
  Top 0.254: IC4.10 182.88,14.73 v183.9,15.75
  Bottom 0.254: 217.68,46.48 217.68,43.94 v210.57,40.13 210.31,39.88 210.31,39.12 211.33,38.1 211.33,19.56 208.53,16.76 205.99,16.76 205.49,17.27 193.04,17.27 192.53,16.76 190.75,16.76 190.25,16.26 184.4,16.26 v183.9,15.75
LR1R  (via drill 0.6)  (1 unrouted)
  Top 0.254: IC4.9 185.42,13.97 v186.69,15.24
  Bottom 0.254: 220.47,46.48 220.47,43.43 v212.6,38.1 211.84,38.1 211.84,19.3 208.79,16.26 205.74,16.26 205.23,16.76 193.29,16.76 192.79,16.26 191.01,16.26 190.5,15.75 187.2,15.75 v186.69,15.24
LR2B  (via drill 0.6)  (1 unrouted)
  Top 0.254: v216.92,11.18 215.9,11.18 212.09,7.37 v208.53,7.37 | v217.68,13.72 208.79,22.61 208.79,31.75 214.38,37.34 v217.17,37.34 | v219.96,37.34 224.03,37.34 227.84,41.15 v228.35,41.15 | v196.85,4.57 196.6,4.83 196.6,7.62 196.85,7.87 196.85,11.18 196.6,11.43 196.6,11.94 195.58,12.95 IC4.5
  Bottom 0.254: v228.35,41.15 234.95,44.45 234.95,46.74 | v216.92,11.18 217.68,11.94 v217.68,13.72 | v219.96,37.34 v217.17,37.34 | v208.53,7.37 208.03,7.87 200.41,7.87 199.14,6.6 199.14,4.83 198.63,4.32 197.1,4.32 v196.85,4.57
LR2G  (via drill 0.6)  (1 unrouted)
  Top 0.254: v226.57,15.24 225.81,14.48 225.81,13.72 224.79,12.7 214.88,12.7 v214.38,13.21 | v228.85,15.75 228.35,16.26 228.35,27.69 228.09,27.94 228.09,28.7 228.35,28.96 228.35,32.26 229.11,33.02 v229.11,33.78 | v227.84,35.05 227.84,37.85 229.36,39.37 v229.36,39.88 | v212.09,12.7 208.79,9.4 v208.53,9.4
  Bottom 0.254: v229.36,39.88 236.22,43.94 236.22,46.74 | v226.57,15.24 228.35,15.24 v228.85,15.75 | v227.84,35.05 v229.11,33.78 | v214.38,13.21 213.87,12.7 v212.09,12.7 | v208.53,9.4 208.28,9.14 208.03,9.14 207.77,8.89 193.04,8.89 192.02,9.91 192.02,10.41 192.79,11.18 195.33,11.18 197.87,13.72 198.12,13.72 IC4.4
LR2R  (via drill 0.6)  (1 unrouted)
  Top 0.254: v231.39,37.85 231.39,37.34 227.84,33.78 227.84,29.21 227.33,28.7 227.33,27.69 227.84,27.18 227.84,14.99 225.04,12.19 213.87,12.19 v208.28,17.78 | v206.25,17.78 204.22,17.78 201.42,14.99 201.42,14.73 200.66,13.97 IC4.3
  Bottom 0.254: v231.39,37.85 239.01,42.93 239.01,46.74 | v206.25,17.78 v208.28,17.78
LR3B  (via drill 0.6)  (1 unrouted)
  Top 0.254: IC4.8 187.96,11.94 v187.45,11.43 | v216.41,18.29 v216.41,16.26
  Bottom 0.254: v216.41,18.29 216.41,28.19 | v187.45,11.43 187.96,11.94 191.01,11.94 191.52,12.45 191.52,15.75 193.04,15.75 193.55,16.26 204.98,16.26 205.49,15.75 209.04,15.75 209.55,16.26 v216.41,16.26
LR3G  (via drill 0.6)  (1 unrouted)
  Top 0.254: IC4.7 190.5,14.73 193.04,17.27 193.8,17.27 194.56,18.03 v194.56,18.8 | v210.31,24.13 210.82,23.62 210.82,21.34 214.88,17.27 v215.39,17.27
  Bottom 0.254: 217.68,28.19 v217.68,17.53 217.42,17.27 v215.39,17.27 | v194.56,18.8 195.07,18.29 204.47,18.29 208.79,22.61 208.79,24.13 v210.31,24.13
LR3R  (via drill 0.6)  (1 unrouted)
  Top 0.254: IC4.6 193.04,13.97 v194.31,15.24 | v204.47,15.24 204.47,15.49 204.98,16 205.49,16 206.76,14.73 206.76,10.92 206.25,10.41 206.25,9.65 207.52,8.38 209.55,8.38 209.55,9.4 210.31,10.16 v210.82,10.16 | v220.22,16 v220.22,13.72
  Bottom 0.254: v220.22,16 220.22,28.19 | v194.31,15.24 194.82,15.75 203.96,15.75 v204.47,15.24 | v210.82,10.16 217.17,10.16 220.22,13.21 v220.22,13.72
LR4B  (via drill 0.6)  (1 unrouted)
  Top 0.254: v221.49,4.32 221.49,4.06 220.22,2.79 210.82,2.79 207.52,6.1 207.52,6.35 205.99,7.87 205.74,7.87 204.22,9.4 v204.22,11.18 | v220.22,5.59 220.22,5.84 231.9,17.53 233.68,17.53 234.44,18.29 v234.95,18.29
  Bottom 0.254: v234.95,18.29 234.95,28.19 | v220.22,5.59 v221.49,4.32 | v204.22,11.18 203.71,11.68 203.71,13.72 203.2,13.72 IC4.2
LR4G  (via drill 0.6)  (1 unrouted)
  Top 0.254: v236.22,17.53 236.22,17.27 235.2,16.26 232.16,16.26 219.96,4.06 210.57,4.06 207.26,7.37 207.26,7.87 205.74,9.4 v205.74,11.18
  Bottom 0.254: v236.22,17.53 236.22,28.19 | IC4.1 v205.74,11.18
LR4R  (via drill 0.6)  (1 unrouted)
  Top 0.254: v238.76,16 238.76,15.49 236.47,13.21 236.47,8.13 230.63,2.29 210.57,2.29 206.5,6.35 205.74,6.35 IC4.28
  Bottom 0.254: v238.76,16 238.76,28.19
N$10  (via drill 0.6)
  Top 0.254: v140.97,10.67 v140.97,8.64 | IC3.20 v121.92,10.67
  Bottom 0.254: v140.97,8.64 144.78,8.64 146.05,9.91 148.08,9.91 R3.2 | v140.97,10.67 140.46,10.16 122.43,10.16 v121.92,10.67
N$13  (via drill 0.6)
  Top 0.254: v74.93,7.87 74.93,9.65 R2.2
  Bottom 0.254: v74.93,7.87 41.66,7.87 39.88,6.1 39.37,6.1 IC2.20
N$14
  Top 0.406: IC2.17 31.68,6.07 31.68,1.07 137.16,1.07 IC3.26
N$15  (via drill 0.6)
  Top 0.254: v164.08,2.29 v164.08,5.84 | IC4.26 v200.66,3.05 | v143.76,9.65 v143.76,6.6 | IC3.17 v114.3,9.65
  Bottom 0.254: v164.08,2.29 164.59,1.78 191.52,1.78 192.79,3.05 v200.66,3.05 | v164.08,5.84 163.32,6.6 v143.76,6.6 | v114.3,9.65 v143.76,9.65
N$16  (via drill 0.6)
  Top 0.254: v228.09,8.38 228.09,9.65 R4.2 | IC4.20 v185.42,8.38
  Bottom 0.254: v185.42,8.38 v228.09,8.38
PLOAD  (via drill 0.6)
  Top 0.254: v61.98,75.69 64.77,75.69 v65.53,74.93 | v68.07,72.39 72.14,68.33 78.49,68.33 81.28,71.12 82.55,71.12 IC5.1
  Bottom 0.254: IC1.D3 47.5,76.96 48.77,75.95 59.94,75.95 60.2,75.69 v61.98,75.69 | v68.07,72.39 v65.53,74.93 | IC5.1 84.84,71.37 85.85,72.39 104.39,72.39 105.41,71.37 IC6.1 112.78,71.37 113.79,72.39 132.33,72.39 133.35,71.37 IC7.1 140.72,71.37 141.73,72.39 160.27,72.39 161.29,71.37 IC8.1 168.4,71.37 169.42,72.39 189.74,72.39 190.75,71.37 IC9.1
RST  (via drill 0.6)
  Top 0.254: v219.96,85.09 219.96,92.2 218.44,93.73 v218.44,95.25 | v235.97,84.58 235.97,91.69 EXPANSION.7 | v76.96,70.61 v76.96,94.23 | v55.63,70.1 55.63,71.88 IC1.RST
  Bottom 0.254: v219.96,85.09 235.46,85.09 v235.97,84.58 | v218.44,95.25 218.44,95.76 188.47,95.76 186.94,94.23 186.44,94.23 185.42,95.25 163.58,95.25 162.56,94.23 158.5,94.23 157.48,95.25 136.14,95.25 135.13,94.23 130.56,94.23 129.54,95.25 108.2,95.25 107.19,94.23 102.62,94.23 101.6,95.25 80.26,95.25 79.25,94.23 v76.96,94.23 | v76.96,70.61 76.45,70.1 v55.63,70.1
SCLK  (via drill 0.6)
  Top 0.254: IC3.25 v134.62,2.79 | IC2.25 52.07,6.1 50.8,6.1 50.8,15.24 46.99,16.51 46.99,67.06 v47.5,67.82 | v51.82,67.82 51.82,72.39 51.31,73.41 v51.31,94.74 | v87.63,9.91 v111.51,9.91
  Bottom 0.254: v134.62,2.79 135.13,2.29 148.84,2.29 150.37,3.81 164.59,3.81 165.61,2.79 191.01,2.79 192.02,3.81 192.02,7.87 195.83,7.87 197.61,6.1 198.12,6.1 IC4.25 | v51.82,67.82 v47.5,67.82 | IC1.B1 v51.31,94.74 | IC2.25 52.07,4.06 87.63,4.06 v87.63,9.91 | v111.51,9.91 111.51,8.38 134.62,8.38 IC3.25
SHIFT-CLK  (via drill 0.6)
  Top 0.254: v58.17,73.41 58.17,71.88 IC1.D4 | v61.98,73.15 62.23,73.41 69.85,73.41 73.66,69.6 77.22,69.6 81.28,73.66 82.55,73.66 IC5.2
  Bottom 0.254: v58.17,73.41 58.42,73.15 v61.98,73.15 | IC5.2 84.58,73.91 85.6,72.9 104.65,72.9 105.66,73.91 IC6.2 112.52,73.91 113.54,72.9 132.59,72.9 133.6,73.91 IC7.2 140.46,73.91 141.48,72.9 160.53,72.9 161.54,73.91 IC8.2 168.66,73.91 169.67,72.9 189.48,72.9 190.5,73.91 IC9.2
SHIFT-DATA
  Bottom 0.254: IC5.9 70.1,89.15 62.99,82.04 62.99,71.88 IC1.D6
SIN  (via drill 0.6)
  Top 0.254: IC2.26 54.61,6.1 55.88,6.1 v55.88,17.02 | v49.53,17.02 47.5,17.02 47.5,65.02 49.02,66.55 v49.02,70.1 | v50.29,73.41 50.8,73.91 50.8,91.69 v50.29,92.2
  Bottom 0.254: v49.53,17.02 v55.88,17.02 | v49.02,70.1 49.02,73.41 v50.29,73.41 | IC1.B2 v50.29,92.2
SWCH1  (via drill 0.6)
  Top 0.254: v164.08,31.24 164.08,71.37 162.81,72.64 v162.81,81.53
  Bottom 0.254: RN4.8 IC8.5 v162.81,81.53 | v164.08,31.24 163.58,30.73 155.7,30.73 155.19,31.24 154.69,31.24 154.18,30.73 137.67,30.73 137.16,31.24 136.65,31.24 136.14,30.73 119.13,30.73 118.62,31.24 118.11,31.24 117.6,30.73 100.58,30.73 100.08,31.24 99.57,31.24 99.06,30.73 81.28,30.73 81.03,30.48 60.45,30.48 58.42,28.45 SWCH1.P$2
SWCH2  (via drill 0.6)
  Top 0.254: v71.63,31.5 v71.63,28.96 | v165.1,33.02 164.59,33.53 164.59,72.39 164.85,72.64 164.85,73.15 164.59,73.41 164.59,74.93 164.85,75.18 164.85,75.69 164.34,76.2 v164.34,84.07
  Bottom 0.254: RN4.9 IC8.6 v164.34,84.07 | v71.63,28.96 73.91,28.96 74.68,28.19 76.71,28.19 SWCH2.P$2 | v71.63,31.5 72.14,30.99 80.77,30.99 81.03,31.24 98.81,31.24 99.31,31.75 100.33,31.75 100.84,31.24 117.35,31.24 117.86,31.75 118.87,31.75 119.38,31.24 135.89,31.24 136.4,31.75 137.41,31.75 137.92,31.24 153.92,31.24 154.43,31.75 155.45,31.75 155.96,31.24 162.81,31.24 164.59,33.02 v165.1,33.02
SWCH3  (via drill 0.6)
  Top 0.254: v90.17,28.96 90.42,29.21 v90.42,59.94 | v200.91,66.29 v200.91,62.74
  Bottom 0.254: IC9.11 188.98,84.07 189.99,83.06 200.66,83.06 201.17,82.55 204.47,82.55 204.98,82.04 204.98,66.29 RN5.2 v200.91,66.29 | v90.17,28.96 92.46,28.96 93.22,28.19 95.25,28.19 SWCH3.P$2 | v90.42,59.94 90.42,60.45 92.2,62.23 92.96,62.23 93.47,62.74 117.35,62.74 117.86,62.23 120.9,62.23 121.41,62.74 145.29,62.74 145.8,62.23 148.84,62.23 149.35,61.72 149.86,61.72 151.38,63.25 173.48,63.25 173.99,62.74 176.53,62.74 177.04,63.25 200.41,63.25 v200.91,62.74
SWCH4  (via drill 0.6)
  Top 0.254: v200.66,75.44 v200.66,80.01 | v108.71,61.72 v108.71,29.21 | v178.31,62.23 178.31,81.03 v178.82,81.53
  Bottom 0.254: v200.66,80.01 200.91,80.01 200.41,80.52 189.99,80.52 188.98,81.53 IC9.12 v178.82,81.53 | v200.66,75.44 200.66,68.83 RN5.3 | v108.71,29.21 110.74,29.21 111.76,28.19 113.79,28.19 SWCH4.P$2 | v108.71,61.72 109.22,62.23 117.09,62.23 117.6,61.72 121.16,61.72 121.67,62.23 145.03,62.23 145.54,61.72 148.59,61.72 149.1,61.21 150.11,61.21 151.64,62.74 173.23,62.74 173.74,62.23 v178.31,62.23
SWCH5  (via drill 0.6)
  Top 0.254: v199.64,77.47 199.64,74.42 201.42,72.64 v201.68,72.64 | v127,61.21 v127,29.21 | v179.32,61.21 179.32,62.48 178.82,62.99 178.82,78.49 v179.32,78.99
  Bottom 0.254: v199.64,77.47 199.14,77.47 198.63,77.98 189.99,77.98 188.98,78.99 IC9.13 v179.32,78.99 | v201.68,72.64 201.68,71.37 RN5.4 | v127,29.21 129.29,29.21 130.3,28.19 132.33,28.19 SWCH5.P$2 | v127,61.21 127.51,61.72 144.78,61.72 145.29,61.21 148.34,61.21 148.84,60.71 150.37,60.71 151.89,62.23 172.97,62.23 173.48,61.72 177.55,61.72 178.05,61.21 v179.32,61.21
SWCH6  (via drill 0.6)
  Top 0.254: v196.09,75.18 196.85,75.95 196.85,78.49 199.9,81.53 200.66,81.53 200.91,81.28 200.91,81.03 201.68,80.26 201.68,79.76 201.17,79.25 201.17,78.23 v201.68,77.72 201.17,77.22 201.17,76.2 203.2,74.17 RN5.5 | v145.29,26.92 145.29,41.4 145.54,41.66 v145.54,60.2 | v180.34,60.2 180.34,61.47 179.83,61.98 179.83,62.74 179.32,63.25 179.32,75.95 v179.83,76.45
  Bottom 0.254: v196.09,75.18 195.83,75.44 189.99,75.44 188.98,76.45 IC9.14 v179.83,76.45 | v201.68,77.72 201.93,77.47 | v145.29,26.92 147.07,26.92 148.34,28.19 150.37,28.19 SWCH6.P$2 | v145.54,60.2 150.62,60.2 152.15,61.72 172.72,61.72 173.23,61.21 177.29,61.21 177.8,60.71 178.56,60.71 179.07,60.2 v180.34,60.2
SWCH7  (via drill 0.6)
  Top 0.254: v163.32,28.96 163.07,29.21 163.07,31.5 163.58,32 163.58,69.34 v163.07,69.85 | v189.74,69.85 190.25,70.36 v190.25,76.45
  Bottom 0.254: RN5.6 IC9.3 v190.25,76.45 | v163.32,28.96 165.86,28.96 166.62,28.19 168.66,28.19 SWCH7.P$2 | v189.74,69.85 v163.07,69.85
SWCH8  (via drill 0.6)
  Top 0.254: v181.86,31.24 v181.86,28.96 | v206.25,30.73 206.76,31.24 206.76,75.69 204.47,77.98 203.2,77.98 RN5.7
  Bottom 0.254: IC9.4 RN5.7 | v181.86,28.96 184.4,28.96 185.17,28.19 187.2,28.19 SWCH8.P$2 | v181.86,31.24 182.37,30.73 v206.25,30.73
SWL1  (via drill 0.6)
  Top 0.254: v191.52,70.36 191.77,70.61 v191.77,81.53
  Bottom 0.254: RN5.8 IC9.5 v191.77,81.53 | v191.52,70.36 185.93,64.77 177.29,64.77 176.78,65.28 173.74,65.28 173.23,64.77 149.35,64.77 148.84,65.28 145.8,65.28 145.29,64.77 121.41,64.77 120.9,65.28 117.86,65.28 117.35,64.77 93.47,64.77 92.96,65.28 85.09,65.28 85.09,58.17 82.3,55.37 29.72,55.37 28.7,56.39 28.19,56.39 26.67,54.86 21.34,54.86 17.02,50.55 13.21,50.55 13.21,47.5 12.45,46.74 SWL1.P$2
SWL2  (via drill 0.6)
  Top 0.254: v28.45,55.37 v28.45,53.34
  Bottom 0.254: IC9.6 RN5.9 203.71,84.07 205.49,82.3 205.49,66.04 205.23,65.79 204.98,65.79 204.47,65.28 202.44,65.28 201.42,64.26 177.04,64.26 176.53,64.77 173.99,64.77 173.48,64.26 149.1,64.26 148.59,64.77 146.05,64.77 145.54,64.26 121.16,64.26 120.65,64.77 118.11,64.77 117.6,64.26 93.22,64.26 92.71,64.77 85.6,64.77 85.6,57.91 82.55,54.86 28.96,54.86 v28.45,55.37 | v28.45,53.34 28.45,49.02 30.73,46.74 SWL2.P$2
SWL3  (via drill 0.6)
  Top 0.254: v17.27,43.94 18.03,43.94 18.03,44.2 19.3,45.47 19.3,47.75 v18.29,48.77 | v22.61,55.88 v22.61,53.34
  Bottom 0.254: v17.27,43.94 17.27,33.27 12.45,28.45 SWL3.P$2 | v18.29,48.77 18.29,50.29 21.34,53.34 v22.61,53.34 | v22.61,55.88 26.92,55.88 27.94,56.9 35.56,56.9 46.48,67.82 46.48,70.1 46.99,70.61 46.99,71.88 IC1.D5
SWL4  (via drill 0.6)
  Top 0.254: v26.42,24.13 25.65,24.89 v25.65,25.91 | v27.43,52.58 27.43,56.13 28.19,56.9 v28.19,57.91
  Bottom 0.254: v26.42,24.13 26.42,24.64 29.97,28.19 30.73,28.19 SWL4.P$2 | v25.65,25.91 26.16,25.91 28.19,27.94 28.19,48.51 27.94,48.77 27.94,52.58 v27.43,52.58 | v28.19,57.91 31.24,60.96 31.24,70.87 39.12,70.87 42.67,74.42 IC1.C6
SWR1  (via drill 0.6)
  Top 0.254: v251.97,62.23 252.22,62.48 252.22,87.12 v251.97,87.38
  Bottom 0.254: v251.97,62.23 252.22,62.23 238.51,50.04 216.15,50.04 214.88,47.24 214.88,46.74 214.63,46.74 SWR1.P$2 | v251.97,87.38 228.09,87.38 226.82,88.65 226.31,88.65 226.06,88.9 226.06,91.19 219.46,97.79 69.6,97.79 67.56,95.76 66.04,95.76 63.5,93.22 63.5,91.95 62.23,91.95 61.98,92.2 IC1.F4
SWR2  (via drill 0.6)
  Top 0.254: v251.21,81.28 251.71,80.77 251.71,64.26 250.95,62.99 v250.95,48.77
  Bottom 0.254: IC1.F5 61.72,89.66 63.5,91.44 64.01,91.44 64.01,92.96 66.29,95.25 67.82,95.25 69.85,97.28 219.2,97.28 225.55,90.93 225.55,88.65 226.06,88.14 226.57,88.14 227.84,86.87 251.21,86.87 v251.21,81.28 | v250.95,48.77 234.7,48.77 233.17,46.48 SWR2.P$2
SWR3  (via drill 0.6)
  Top 0.254: v249.43,77.47 249.43,66.04 249.68,65.79 v249.68,30.23
  Bottom 0.254: v249.43,77.47 248.92,78.23 248.67,78.74 246.63,80.77 246.38,80.77 240.79,86.36 227.58,86.36 226.31,87.63 225.81,87.63 225.04,88.39 225.04,90.68 218.95,96.77 70.1,96.77 68.07,94.74 66.55,94.74 64.52,92.71 64.52,90.93 63.75,90.93 62.23,89.41 62.23,87.12 IC1.F6 | v249.68,30.23 216.15,30.23 214.63,28.45 SWR3.P$2
SWR4  (via drill 0.6)  (1 unrouted)
  Top 0.254: v247.4,78.49 v247.4,64.77 | v247.4,63.75 247.4,38.86 v247.65,38.61 | v242.82,35.56 v245.62,38.35 | v238,30.99 235.46,30.99 234.19,29.72 233.68,28.19 SWR4.P$2
  Bottom 0.254: IC1.F7 62.74,86.87 62.74,89.15 64.01,90.42 65.28,90.42 65.28,92.71 66.8,93.98 68.33,93.98 70.61,96.27 218.69,96.27 224.28,90.68 224.28,88.14 227.58,85.6 240.54,85.6 247.65,78.49 v247.4,78.49 | v247.4,64.77 v247.4,63.75 | v247.65,38.61 247.4,38.35 v245.62,38.35 | v242.82,35.56 238.25,30.99 v238,30.99
XLAT  (via drill 0.6)
  Top 0.254: IC3.24 v132.08,2.29 | v195.07,4.06 195.58,4.57 IC4.24 | v49.02,79.5 49.02,71.37 46.48,68.83 46.48,16 48.26,15.24 48.26,6.1 49.53,6.1 IC2.24 v49.53,2.29
  Bottom 0.254: v195.07,4.06 194.56,3.56 192.53,3.56 191.26,2.29 165.35,2.29 164.34,3.3 150.62,3.3 149.1,1.78 132.59,1.78 v132.08,2.29 131.32,3.05 129.29,3.05 128.02,1.78 50.04,1.78 v49.53,2.29 | IC1.B5 v49.02,79.5